# Altium project MEGA2560_Rev3e.PrjPcb
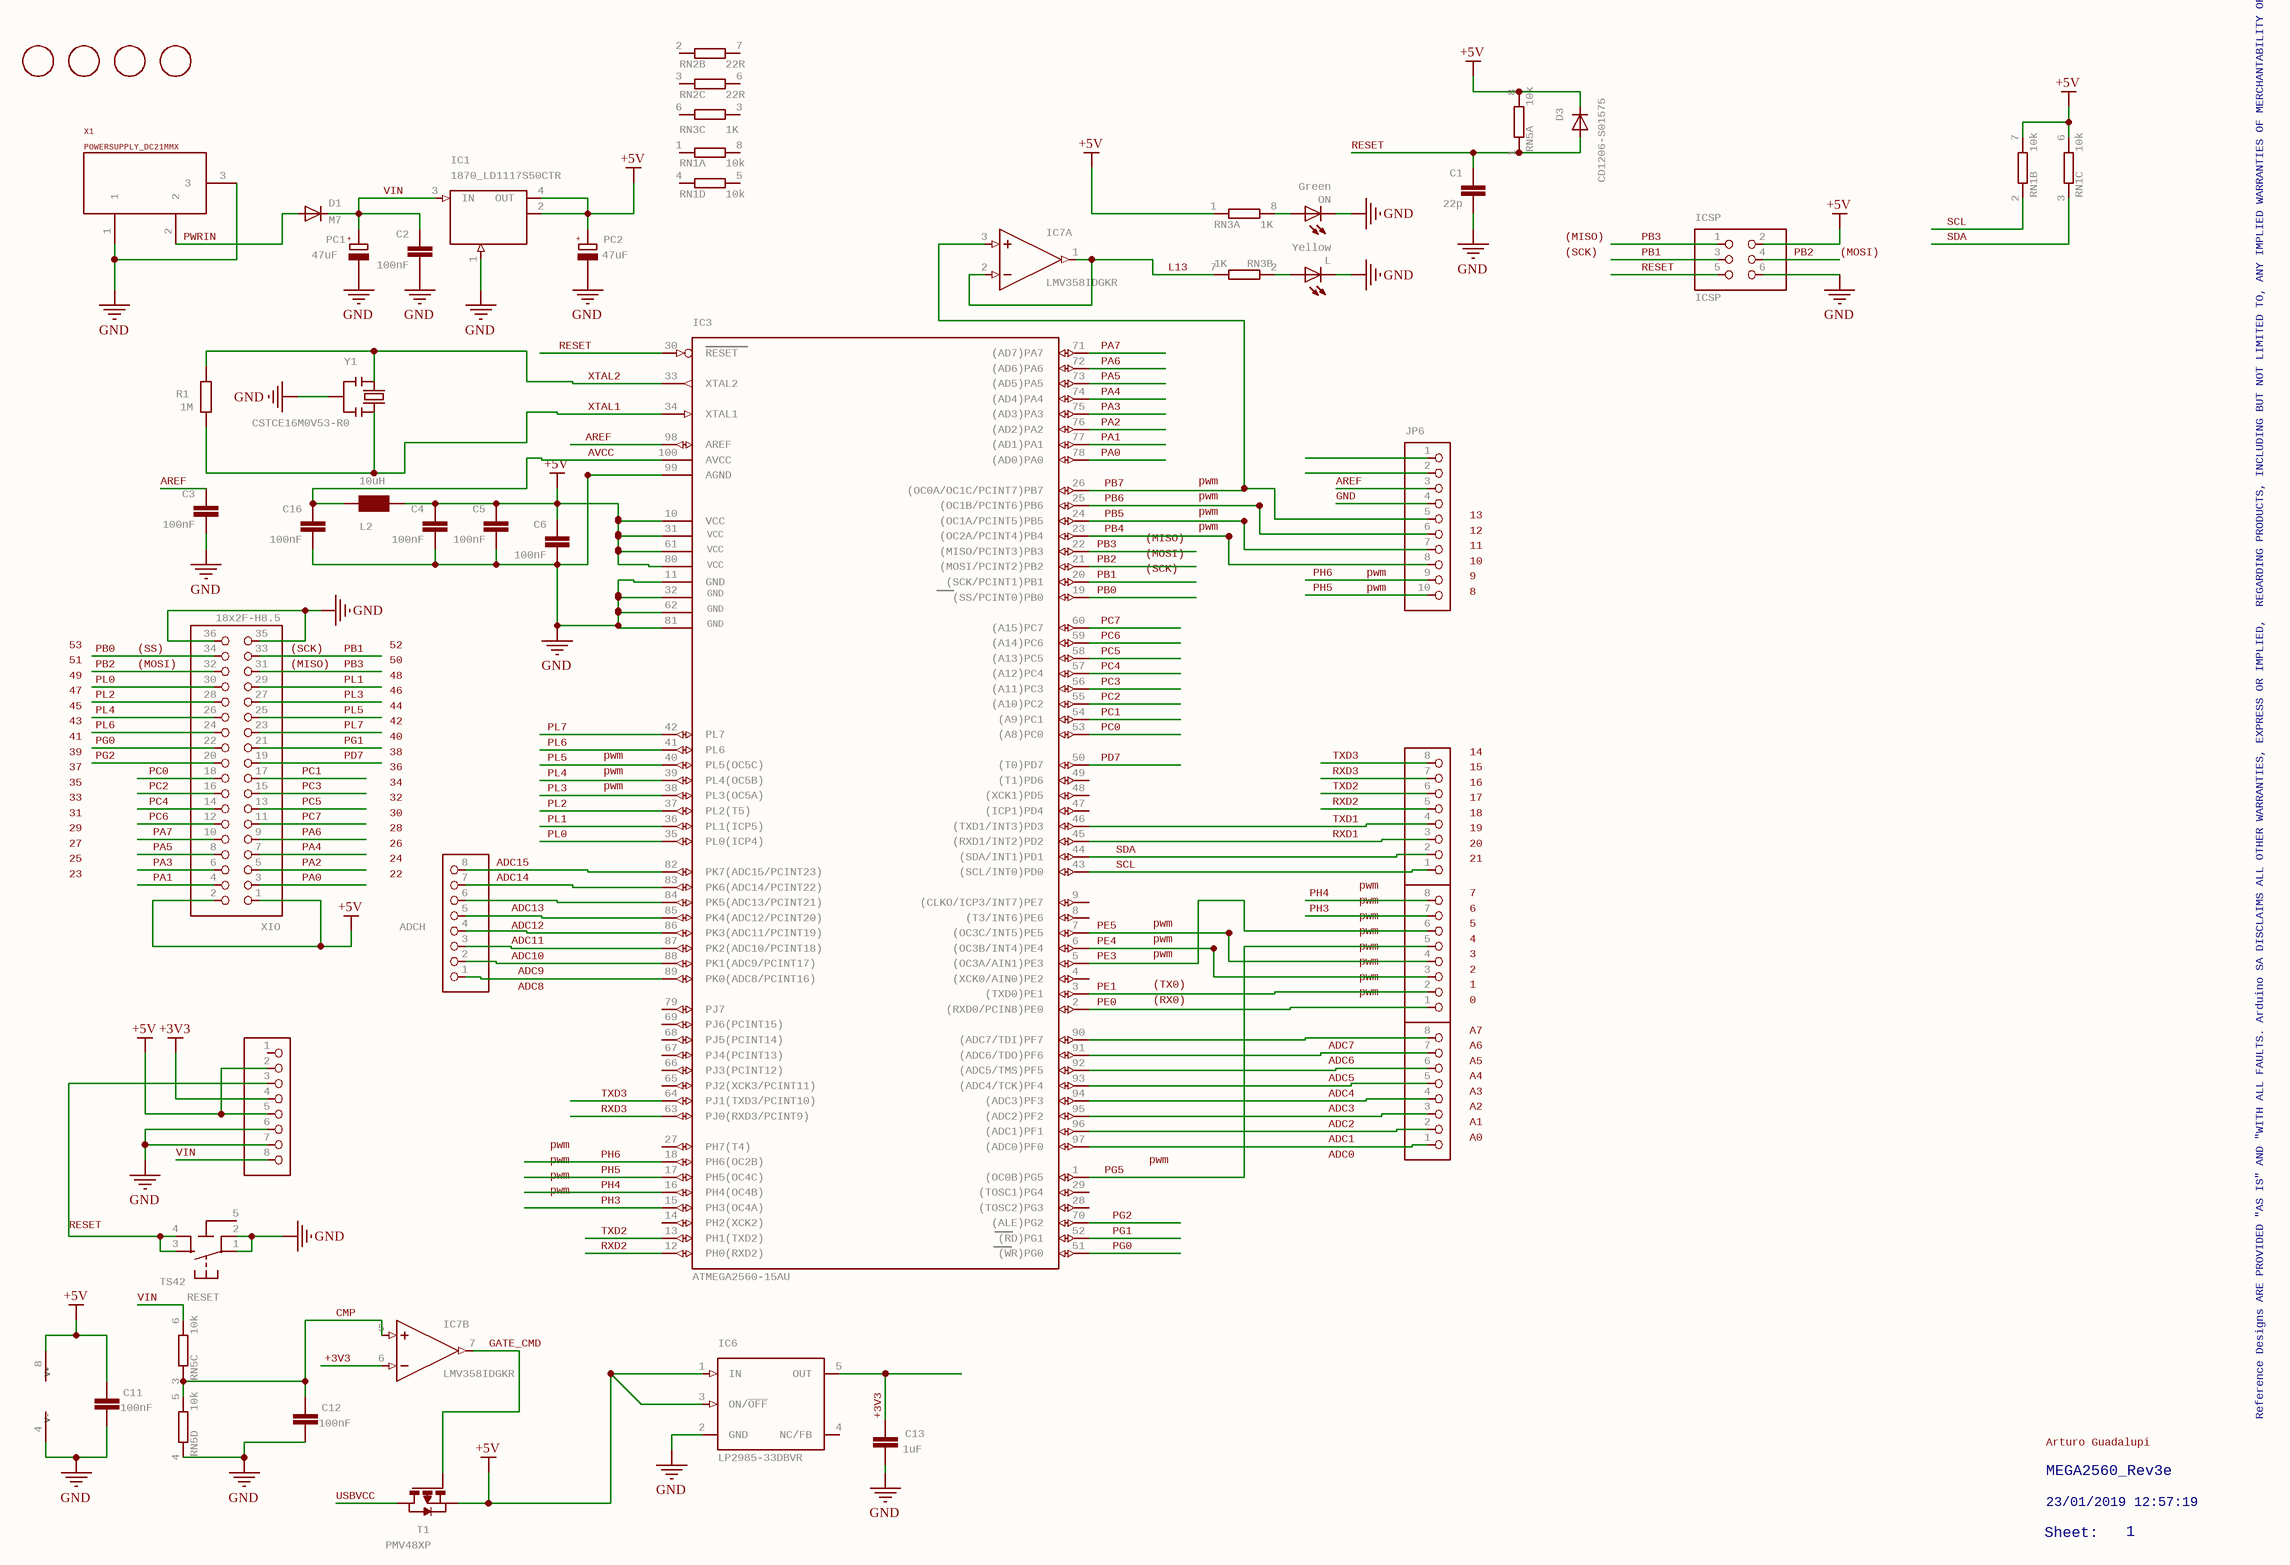
[diagram p0: MEGA2560_Rev3e_0.SchDoc]
2 sheets, 64 parts. Net scope: global (net labels, ports and power ports of the same name join across sheets).
Board file: MEGA2560_Rev3e.PcbDoc
Sheets:
  MEGA2560_Rev3e_0.SchDoc
  MEGA2560_Rev3e_1.SchDoc

## Sheet MEGA2560_Rev3e_0.SchDoc: MEGA2560_Rev3e
size 409 x 293 mm; Origin: Eagle; Date: 23/01/2019 12:57:19; SheetNumber: 1; CODE-ARDUINO: DNP; DATASHEET: DNP; DISTRIBUTOR-LINK: DNP; DISTRIBUTOR-PN: DNP; MANUFACTURER: DNP; MANUFACTURER-PN: DNP; NOTE: DNP; Value: DNP; GateName_1: G$1; SymbolName_1: A3L-LOC; LibraryName: Arduino-utility; DeviceSetName: A3-FRAME; Sheet: Sheet:; ReferenceDesignsAREPROVIDED"ASIS"AND"WITHALLFAULTS.ArduinoSADISCLAIMSALLOTHERWARRANTIES,EXPRESSORIMPLIED,
REGARDINGPRODUCTS,INCLUDINGBUTNOTLIMITEDTO,ANYIMPLIEDWARRANTIESOFMERCHANTABILITYORFITNESSFORAPARTICULARPURPOSE

ArduinoSAmaymakechangestospecificationsandproductdescriptionsatanytime,withoutnotice.TheCustomermustnot
relyontheabsenceorcharacteristicsofanyfeaturesorinstructionsmarked"reserved"or"undefined."ArduinoSAreserves
theseforfuturedefinitionandshallhavenoresponsibilitywhatsoeverforconflictsorincompatibilitiesarisingfromfuturechangestothem.
TheproductinformationontheWebSiteorMaterialsissubjecttochangewithoutnotice.Donotfinalizeadesignwiththisinfo

ARDUINOandotherArduinobrandsandlogosandTrademarksofArduinoSA.AllArduinoSATrademarkscannotbeusedwithoutowner'sformalpermission: Reference Designs ARE PROVIDED "AS IS" AND "WITH ALL FAULTS. Arduino SA DISCLAIMS ALL OTHER WARRANTIES, EXPRESS OR IMPLIED, / REGARDING PRODUCTS, INCLUDING BUT NOT LIMITED TO, ANY IMPLIED WARRANTIES OF MERCHANTABILITY OR FITNESS FOR A PARTICULAR PURPOSE / Arduino SA may make changes to specifications and product descriptions at any time, without notice. The Customer must not / rely on the absence or characteristics of any features or instructions marked "reserved" or "undefined." Arduino SA reserves / these for future definition and shall have no responsibility whatsoever for conflicts or incompatibilities arising from future changes to them. / The product information on the Web Site or Materials is subject to change without notice. Do not finalize a design with this info / ARDUINO and other Arduino brands and logos and Trademarks of Arduino SA. All Arduino SA Trademarks cannot be used without owner's formal permission

### Parts
ADCH  FH254-108DF08500V  [1X08]  (value not drawn)
ADCL  FH254-108DF08500V  [1X08]  (value not drawn)
C1  22p  [C0603-ROUND]
C2  100nF  [C0603-ROUND]
C3  100nF  [C0603-ROUND]
C4  100nF  [C0603-ROUND]
C5  100nF  [C0603-ROUND]
C6  100nF  [C0603-ROUND]
C11  100nF  [C0603-ROUND]
C12  100nF  [C0603-ROUND]
C13  1uF  [C0603-ROUND]
C16  100nF  [C0603-ROUND]
COMMUNICATION  FH254-108DF08500V  [1X08]  (value not drawn)
D1  M7  [SMB]
D3  CD1206-S01575  [MINIMELF]
FD1  FIDUCIALMOUNT  [FIDUCIA-MOUNT]  (value not drawn)
FD2  FIDUCIALMOUNT  [FIDUCIA-MOUNT]  (value not drawn)
FD3  FIDUCIALMOUNT  [FIDUCIA-MOUNT]  (value not drawn)
FD4  FIDUCIALMOUNT  [FIDUCIA-MOUNT]  (value not drawn)
IC1  1870_LD1117S50CTR  [LINEAR_SOT223]
IC3  ATMEGA2560-15AU  [TQFP100]
IC6  LP2985-33DBVR  [SOT23-DBV]
IC7  LMV358IDGKR  [MSOP08]  (parts A,B,C of 3)
ICSP  ICSP  [2X03]
JP6  FH254-110DF08500V  [1X10]  (value not drawn)
L  Yellow  [CHIPLED_0805]
L2  10uH  [0805]
ON  Green  [CHIPLED_0805]
PC1  47uF  [PANASONIC_D]
PC2  47uF  [PANASONIC_D]
POWER  FH254-108DF08500V  [1X08]  (value not drawn)
PWML  FH254-108DF08500V  [1X08]  (value not drawn)
R1  1M  [R0603-ROUND]
RESET  TS42  [TS42]
RN1  10k  [CAY16]  (parts A,B,C,D of 4)
RN2  22R  [CAY16]  (parts B,C of 4)
RN3  1K  [CAY16]  (parts A,B,C of 4)
RN5  10k  [CAY16]  (parts A,C,D of 4)
T1  PMV48XP  [SOT-23]
X1  POWERSUPPLY_DC21MMX  [POWERSUPPLY_DC-21MM]
XIO  18x2F-H8.5  [2X18]
Y1  CSTCE16M0V53-R0  [RESONATOR]

### Nets
+3V3: C13.2 IC6.5(OUT) IC7.6(-IN) POWER.4
+5V: C4.1 C5.1 C6.1 C11.2 D3.C IC1.2(OUT) IC1.4(OUT) IC3.10(VCC) IC3.31(VCC1) IC3.61(VCC2) IC3.80(VCC3) IC6.1(IN) IC6.3(ON/~{OFF}) IC7.8(V+) ICSP.2 L2.2 PC2.+ POWER.2 POWER.5 RN1.6 RN1.7 RN3.1 RN5.8 T1.2(S) XIO.1 XIO.2
GND: C1.2 C2.2 C3.2 C4.2 C5.2 C6.2 C11.1 C12.1 C13.1 C16.2 IC1.1(GND/ADJ) IC3.11(GND) IC3.32(GND1) IC3.62(GND2) IC3.81(GND3) IC3.99(AGND) IC6.2(GND) IC7.4(V-) ICSP.6 JP6.4 L.C ON.C PC1.- PC2.- POWER.6 POWER.7 RESET.1 RESET.2 RN5.4 X1.1 X1.3 XIO.35 XIO.36 Y1.2
ADC0: ADCL.1 IC3.97((ADC0)PF0)
ADC1: ADCL.2 IC3.96((ADC1)PF1)
ADC2: ADCL.3 IC3.95((ADC2)PF2)
ADC3: ADCL.4 IC3.94((ADC3)PF3)
ADC4: ADCL.5 IC3.93((ADC4/TCK)PF4)
ADC5: ADCL.6 IC3.92((ADC5/TMS)PF5)
ADC6: ADCL.7 IC3.91((ADC6/TDO)PF6)
ADC7: ADCL.8 IC3.90((ADC7/TDI)PF7)
ADC8: ADCH.1 IC3.89(PK0(ADC8/PCINT16))
ADC9: ADCH.2 IC3.88(PK1(ADC9/PCINT17))
ADC10: ADCH.3 IC3.87(PK2(ADC10/PCINT18))
ADC11: ADCH.4 IC3.86(PK3(ADC11/PCINT19))
ADC12: ADCH.5 IC3.85(PK4(ADC12/PCINT20))
ADC13: ADCH.6 IC3.84(PK5(ADC13/PCINT21))
ADC14: ADCH.7 IC3.83(PK6(ADC14/PCINT22))
ADC15: ADCH.8 IC3.82(PK7(ADC15/PCINT23))
AREF: C3.1 IC3.98(AREF) JP6.3
AVCC: C16.1 IC3.100(AVCC) L2.1
CMP: C12.2 IC7.5(+IN) RN5.3 RN5.5
GATE_CMD: IC7.7(OUT) T1.3(G)
L13: IC7.1(OUT) IC7.2(-IN) RN3.7
PA0: IC3.78((AD0)PA0) XIO.3
PA1: IC3.77((AD1)PA1) XIO.4
PA2: IC3.76((AD2)PA2) XIO.5
PA3: IC3.75((AD3)PA3) XIO.6
PA4: IC3.74((AD4)PA4) XIO.7
PA5: IC3.73((AD5)PA5) XIO.8
PA6: IC3.72((AD6)PA6) XIO.9
PA7: IC3.71((AD7)PA7) XIO.10
PB0: IC3.19((SS/PCINT0)PB0) XIO.34
PB1: IC3.20((SCK/PCINT1)PB1) ICSP.3 XIO.33
PB2: IC3.21((MOSI/PCINT2)PB2) ICSP.4 XIO.32
PB3: IC3.22((MISO/PCINT3)PB3) ICSP.1 XIO.31
PB4: IC3.23((OC2A/PCINT4)PB4) JP6.8
PB5: IC3.24((OC1A/PCINT5)PB5) JP6.7
PB6: IC3.25((OC1B/PCINT6)PB6) JP6.6
PB7: IC3.26((OC0A/OC1C/PCINT7)PB7) IC7.3(+IN) JP6.5
PC0: IC3.53((A8)PC0) XIO.18
PC1: IC3.54((A9)PC1) XIO.17
PC2: IC3.55((A10)PC2) XIO.16
PC3: IC3.56((A11)PC3) XIO.15
PC4: IC3.57((A12)PC4) XIO.14
PC5: IC3.58((A13)PC5) XIO.13
PC6: IC3.59((A14)PC6) XIO.12
PC7: IC3.60((A15)PC7) XIO.11
PD7: IC3.50((T0)PD7) XIO.19
PE0: IC3.2((RXD0/PCIN8)PE0) PWML.1
PE1: IC3.3((TXD0)PE1) PWML.2
PE3: IC3.5((OC3A/AIN1)PE3) PWML.6
PE4: IC3.6((OC3B/INT4)PE4) PWML.3
PE5: IC3.7((OC3C/INT5)PE5) PWML.4
PG0: IC3.51((WR)PG0) XIO.22
PG1: IC3.52((RD)PG1) XIO.21
PG2: IC3.70((ALE)PG2) XIO.20
PG5: IC3.1((OC0B)PG5) PWML.5
PH3: IC3.15(PH3(OC4A)) PWML.7
PH4: IC3.16(PH4(OC4B)) PWML.8
PH5: IC3.17(PH5(OC4C)) JP6.10
PH6: IC3.18(PH6(OC2B)) JP6.9
PL0: IC3.35(PL0(ICP4)) XIO.30
PL1: IC3.36(PL1(ICP5)) XIO.29
PL2: IC3.37(PL2(T5)) XIO.28
PL3: IC3.38(PL3(OC5A)) XIO.27
PL4: IC3.39(PL4(OC5B)) XIO.26
PL5: IC3.40(PL5(OC5C)) XIO.25
PL6: IC3.41(PL6) XIO.24
PL7: IC3.42(PL7) XIO.23
PWRIN: D1.A X1.2
RESET: C1.1 D3.A IC3.30(RESET) ICSP.5 POWER.3 RESET.3 RESET.4 RN5.1
RXD1: COMMUNICATION.3 IC3.45((RXD1/INT2)PD2)
RXD2: COMMUNICATION.5 IC3.12(PH0(RXD2))
RXD3: COMMUNICATION.7 IC3.63(PJ0(RXD3/PCINT9))
SCL: COMMUNICATION.1 IC3.43((SCL/INT0)PD0) RN1.2
SDA: COMMUNICATION.2 IC3.44((SDA/INT1)PD1) RN1.3
TXD1: COMMUNICATION.4 IC3.46((TXD1/INT3)PD3)
TXD2: COMMUNICATION.6 IC3.13(PH1(TXD2))
TXD3: COMMUNICATION.8 IC3.64(PJ1(TXD3/PCINT10))
USBVCC: T1.1(D)
VIN: C2.1 D1.C IC1.3(IN) PC1.+ POWER.8 RN5.6
XTAL1: IC3.34(XTAL1) R1.1 Y1.3
XTAL2: IC3.33(XTAL2) R1.2 Y1.1
NetL_A: L.A RN3.2
NetON_A: ON.A RN3.8

Not connected (* = marked no-connect by the designer): IC3 4((XCK0/AIN0)PE2) 8((T3/INT6)PE6) 9((CLKO/ICP3/INT7)PE7) 14(PH2(XCK2)) 27(PH7(T4)) 28((TOSC2)PG3) 29((TOSC1)PG4) 47((ICP1)PD4) 48((XCK1)PD5) 49((T1)PD6) 65(PJ2(XCK3/PCINT11)) 66(PJ3(PCINT12)) 67(PJ4(PCINT13)) 68(PJ5(PCINT14)) 69(PJ6(PCINT15)) 79(PJ7); IC6 4(NC/FB); JP6 1 2; POWER 1; RESET 5(5-GND); RN1 1 4(1) 5(2) 8(2); RN2 2(1) 3(1) 6(2) 7(2); RN3 3(1) 6(2)

### Notes on the sheet
- (SCK)
- (MISO)
- (MOSI)
- pwm
- (near JP6) pwm
- (near JP6) 9
- (near JP6) 10
- (near JP6) 11
- (near JP6) 12
- (near JP6) 13
- 53
- (SS)
- (near XIO) (SCK)
- 52
- (near JP6) 8
- 51
- 49
- 47
- 45
- 43
- (near XIO) (MOSI)
- (near XIO) (MISO)
- 50
- 48
- 46
- 44
- 42
- 33
- 35
- 37
- 41
- 39
- 32
- 34
- 36
- 40
- 38
- (near COMMUNICATION) 15
- (near COMMUNICATION) 16
- (near COMMUNICATION) 17
- (near COMMUNICATION) 14
- 23
- 25
- 27
- 29
- 31
- (near ADCH) 22
- (near ADCH) 24
- (near ADCH) 26
- (near ADCH) 28
- 30
- (near COMMUNICATION) 18
- (near COMMUNICATION) 19
- (near COMMUNICATION) 20
- 21
- (near PWML) 3
- (near PWML) 4
- (near PWML) 5
- 6
- 7
- (TX0)
- (RX0)
- 0
- (near PWML) 1
- (near PWML) 2
- A7
- A6
- (near ADCL) A5
- (near ADCL) A4
- (near ADCL) A3
- (near ADCL) A2
- (near ADCL) A1
- (near ADCL) A0
- Reference Designs ARE PROVIDED "AS IS" AND "WITH ALL FAULTS. Arduino SA DISCLAIMS ALL OTHER WARRANTIES, EXPRESS OR IMPLIED,
  REGARDING PRODUCTS, INCLUDING BUT NOT LIMITED TO, ANY IMPLIED WARRANTIES OF MERCHANTABILITY OR FITNESS FOR A PARTICULAR PURPOSE
  Arduino SA may make changes to specifications and product descriptions at any time, without notice. The Customer must not
  rely on the absence or characteristics of any features or instructions marked "reserved" or "undefined." Arduino SA reserves
  these for future definition and shall have no responsibility whatsoever for conflicts or incompatibilities arising from future changes to them.
  The product information on the Web Site or Materials is subject to change without notice. Do not finalize a design with this info
  ARDUINO and other Arduino brands and logos and Trademarks of Arduino SA. All Arduino SA Trademarks cannot be used without owner's formal permission
- Arturo Guadalupi
- MEGA2560_Rev3e
- Sheet:
- 23/01/2019 12:57:19
- 1

### Library data of the parts
ADCH ADCL COMMUNICATION = 0058_FH254-108DF08500V: Female Connector strip for Arduino bases - 8x1 F V h 8,5 p2,54mm; GateName_1: A; SymbolName_1: PINHD8; MONTHLY_USAGE: _____; LibraryName: Connettori; DeviceSetName: 0058_FH254-108DF08500V; CASE: CASE; PART_NUMBER: FH254-108DF08500V; PRICE: _____; SUPPLIER: _____; TYPE: Connettori
C1 = 0014_22PF_0603: 22pF 0603; GateName_1: G$1; SymbolName_1: C-EU; MONTHLY_USAGE: _____; TYPE: Condensatori; LibraryName: Condensatori; DeviceSetName: 0014_22PF_0603; CASE: 0603; PART_NUMBER: 22pF_0603; PRICE: _____; SUPPLIER: _____
C2-C6 C11 C12 C16 = 0015_100NF_0603: 100nF 0603 50V; PART_NUMBER: cl10b104kbnc; GateName_1: G$1; SymbolName_1: C-EU; MONTHLY_USAGE: _____; TYPE: Condensatori; LibraryName: Condensatori; DeviceSetName: 0015_100NF_0603; CASE: 0603; PRICE: _____; SUPPLIER: _____
C13 = 0006_1UF_0603/GRM188R61E105KA12D: 1uF 0603; GateName_1: G$1; SymbolName_1: C-EU; MONTHLY_USAGE: _____; TYPE: Condensatori; LibraryName: Condensatori; DeviceSetName: 0006_1UF_0603/GRM188R61E105KA12D; CASE: 0603; PART_NUMBER: 1uF_0603/GRM188R61E105KA12D; PRICE: _____; SUPPLIER: _____
D1 = 0020_M7: 1.0A 40V SURFACE MOUNT GLASS PASSIVATED RECTIFIER   M7; GateName_1: G$1; SymbolName_1: D; MONTHLY_USAGE: _____; TYPE: Diodi; LibraryName: Diodi; DeviceSetName: 0020_M7; CASE: SMA; PART_NUMBER: M7; PRICE: _____; SUPPLIER: _____
D3 = 0012_CD1206-S01575: small-signal high-speed Switching Diodes   CD1206; GateName_1: G$1; SymbolName_1: D; MONTHLY_USAGE: _____; TYPE: Diodi; LibraryName: Diodi; DeviceSetName: 0012_CD1206-S01575; CASE: 1206; PART_NUMBER: CD1206-S01575; PRICE: _____; SUPPLIER: _____
FD1-FD4 = FIDUCIALMOUNT: GateName_1: G$1; SymbolName_1: FIDUCIAL; LibraryName: SmartPrj; DeviceSetName: FIDUCIALMOUNT
IC1 = 1870_LD1117S50CTR: Low-dropout linear regulator 5V  -LM1117IMPX-5.0; GateName_1: G$1; SymbolName_1: LINEAR_VREG-O2; MONTHLY_USAGE: _____; LibraryName: IntegratedCircuits; DeviceSetName: 1870_LD1117S50CTR; CASE: SOT223; PART_NUMBER: LD1117S50CTR; PRICE: _____; SUPPLIER: _____; TYPE: Circuito_Integrato
IC3 = 0023_ATMEGA2560-16AU: 8-bit Microcontroller with 256K Bytes In-System Programmable Flash - ATMEGA2560-16AU; GateName_1: 1; SymbolName_1: 86-I/O-1; MONTHLY_USAGE: _____; LibraryName: IntegratedCircuits; DeviceSetName: 0023_ATMEGA2560-16AU; GND: GND; VCC: VCC; CASE: TQFP100_14x14; PART_NUMBER: ATMEGA2560-16AU; PRICE: _____; SUPPLIER: _____; TYPE: Circuito_Integrato
IC6 = 0008_TEXLP2985-33DBVR: 150-mA LOW-NOISE LOW-DROPOUT REGULATOR WITH SHUTDOWN   LP2985-33DBVR; GateName_1: G$1; SymbolName_1: LP2985-XXDBVR; MONTHLY_USAGE: _____; LibraryName: IntegratedCircuits; DeviceSetName: 0008_TEXLP2985-33DBVR; CASE: SOT23-5; PART_NUMBER: TEXLP2985-33DBVR; PRICE: _____; SUPPLIER: _____; TYPE: Circuito_Integrato
IC7 = 0021_LMV358IDGKR: Dual low-voltage (2.7 V to 5.5 V), operational amplifiers with rail-to-rail output swing   LMV358IDGKR; GateName_1: A; SymbolName_1: OPAMP; GateName_2: B; GateName_3: P; SymbolName_3: PWR+-; MONTHLY_USAGE: _____; SymbolName_2: OPAMP; LibraryName: IntegratedCircuits; DeviceSetName: 0021_LMV358IDGKR; CASE: MSOP8; PART_NUMBER: LMV358IDGKR; PRICE: _____; SUPPLIER: _____; TYPE: Circuito_Integrato
ICSP = 0114_PH254-203DF118A00V: 3x2 M V h 8,5 mm p2,54; GateName_1: A; SymbolName_1: PINH2X3; MONTHLY_USAGE: _____; LibraryName: Connettori; DeviceSetName: 0114_PH254-203DF118A00V; CASE: CASE; PART_NUMBER: PH254-203DF118A00V; PRICE: _____; SUPPLIER: _____; TYPE: Connettori
JP6 = 1216_FH254-110DF08500T30: Female Connector strip for Arduino bases - 10x1 F V h 8,5 p2,54 serigrafato STRISCIA VUOTA; GateName_1: A; SymbolName_1: PINHD10; MONTHLY_USAGE: _____; LibraryName: Connettori; DeviceSetName: 1216_FH254-110DF08500T30; CASE: CASE; PART_NUMBER: FH254-110DF08500T30; PRICE: _____; SUPPLIER: _____; TYPE: Connettori
L = 0044_KPT-2012YC: LED YELLOW - SMD - 0805; GateName_1: G$1; MONTHLY_USAGE: _____; SymbolName_1: LED; LibraryName: Opto; DeviceSetName: 0044_KPT-2012YC; CASE: CASE; PART_NUMBER: KPT-2012YC; PRICE: _____; SUPPLIER: _____; TYPE: Opto
L2 = 0715_CV201210-100K: 10uH 0805; GateName_1: G$1; SymbolName_1: L; MONTHLY_USAGE: _____; TYPE: Induttanze; LibraryName: Induttanze; DeviceSetName: 0715_CV201210-100K; CASE: 0805; PART_NUMBER: CV201210-100K; PRICE: _____; SUPPLIER: _____
ON = 0043_KPT-2012SGC: LED GREEN - SMD-0805; GateName_1: G$1; MONTHLY_USAGE: _____; SymbolName_1: LED; LibraryName: Opto; DeviceSetName: 0043_KPT-2012SGC; CASE: CASE; PART_NUMBER: KPT-2012SGC; PRICE: _____; SUPPLIER: _____; TYPE: Opto
PC1 PC2 = 0113_47UF: GateName_1: G$1; SymbolName_1: CPOL; MONTHLY_USAGE: _____; LibraryName: Condensatori; DeviceSetName: 0113_47UF; +: +; CASE: CASE; PART_NUMBER: 47uF; PRICE: _____; SUPPLIER: _____; TYPE: Condensatori
POWER = 1217_FH254-108DF08500T21: Female Connector strip for Arduino bases - 8x1 F V h 8,5 p2,54 serigrafato POWER; GateName_1: A; SymbolName_1: PINHD8; MONTHLY_USAGE: _____; LibraryName: Connettori; DeviceSetName: 1217_FH254-108DF08500T21; CASE: CASE; PART_NUMBER: FH254-108DF08500T21; PRICE: _____; SUPPLIER: _____; TYPE: Connettori
PWML = 1218_FH254-108DF08500T20: Female Connector strip for Arduino bases - 8x1 F V h 8,5 p2,54 serigrafato DIGITAL; GateName_1: A; SymbolName_1: PINHD8; MONTHLY_USAGE: _____; LibraryName: Connettori; DeviceSetName: 1218_FH254-108DF08500T20; CASE: CASE; PART_NUMBER: FH254-108DF08500T20; PRICE: _____; SUPPLIER: _____; TYPE: Connettori
R1 = 0004_0603_1M: 1M 0603; GateName_1: G$1; SymbolName_1: R-EU; MONTHLY_USAGE: _____; LibraryName: Resistenze; DeviceSetName: 0004_0603_1M; CASE: 0603; PART_NUMBER: 0603_1M; PRICE: _____; SUPPLIER: _____; TYPE: Resistenze
RESET = 0946_TS42031-160W-TR-7260: Pushbutton 6x6 Smd - White; PART_NUMBER: IT-1157AHNP-160G-G_GTR; GateName_1: G$1; SymbolName_1: ST-MOD_V1.4_TS42; MONTHLY_USAGE: _____; LibraryName: Switches; DeviceSetName: 0946_TS42031-160W-TR-7260; CASE: CASE; PRICE: _____; SUPPLIER: _____; TYPE: Switches
RN1 RN5 = 0016_064R_10K_/_CAY16-103J4LF: 10K 064 R; GateName_1: A; SymbolName_1: R1NV; GateName_2: B; GateName_3: C; GateName_4: D; MONTHLY_USAGE: _____; SymbolName_2: R1NV; SymbolName_3: R1NV; SymbolName_4: R1NV; LibraryName: Resistenze; DeviceSetName: 0016_064R_10K_/_CAY16-103J4LF; CASE: SMD_3,2x1,6; PART_NUMBER: 064R_10K_/_CAY16-103J4LF; PRICE: _____; SUPPLIER: _____; TYPE: Resistenze
RN2 = 0003_064R_22R_/_CAY16-220J4LF: 22R 064R; GateName_1: A; SymbolName_1: R1NV; GateName_2: B; GateName_3: C; GateName_4: D; MONTHLY_USAGE: _____; SymbolName_2: R1NV; SymbolName_3: R1NV; SymbolName_4: R1NV; LibraryName: Resistenze; DeviceSetName: 0003_064R_22R_/_CAY16-220J4LF; CASE: SMD_3,2x1,6; PART_NUMBER: 064R_22R_/_CAY16-220J4LF; PRICE: _____; SUPPLIER: _____; TYPE: Resistenze
RN3 = 0005_064R_1K_/_CAY16-102J4LF: 1K 064R; GateName_1: A; SymbolName_1: R1NV; GateName_2: B; GateName_3: C; GateName_4: D; MONTHLY_USAGE: _____; SymbolName_2: R1NV; SymbolName_3: R1NV; SymbolName_4: R1NV; LibraryName: Resistenze; DeviceSetName: 0005_064R_1K_/_CAY16-102J4LF; CASE: SMD_3,2x1,6; PART_NUMBER: 064R_1K_/_CAY16-102J4LF; PRICE: _____; SUPPLIER: _____; TYPE: Resistenze
T1 = 0297_PMV48XP: 20 V, 3.5 A P-channel Trench MOSFET - PMV48XP; SymbolName_1: P_MOSFET; MONTHLY_USAGE: _____; TYPE: Transistor; GateName_1: A; LibraryName: Transistors; DeviceSetName: 0297_PMV48XP; CASE: SOT23; PART_NUMBER: PMV48XP; PRICE: _____; SUPPLIER: _____
X1 = POWERSUPPLY_DC21MMX: GateName_1: G$1; SymbolName_1: POWERSUPPLY_DC21PWR; DeviceName: X; LibraryName: SmartPrj; DeviceSetName: POWERSUPPLY_DC21MM
XIO = 0060_FH254-218DF08500V: 18x2 F V h 8,5 p2,54; GateName_1: A; SymbolName_1: PINH2X18; MONTHLY_USAGE: _____; LibraryName: Connettori; DeviceSetName: 0060_FH254-218DF08500V; CASE: CASE; PART_NUMBER: FH254-218DF08500V; PRICE: _____; SUPPLIER: _____; TYPE: Connettori
Y1 = 0011_CSTCE16M0V53-R0: 16Mhz - SMD; GateName_1: G$1; MONTHLY_USAGE: _____; SymbolName_1: RESONATOR; LibraryName: Cristalli; DeviceSetName: 0011_CSTCE16M0V53-R0; CASE: CASE; PART_NUMBER: CSTCE16M0V53-R0; PRICE: _____; SUPPLIER: _____; TYPE: Cristalli

## Sheet MEGA2560_Rev3e_1.SchDoc: MEGA2560_Rev3e
size 409 x 289 mm; Origin: Eagle; Date: 23/01/2019 12:57:19; SheetNumber: 2; CODE-ARDUINO: DNP; DATASHEET: DNP; DISTRIBUTOR-LINK: DNP; DISTRIBUTOR-PN: DNP; MANUFACTURER: DNP; MANUFACTURER-PN: DNP; NOTE: DNP; Value: DNP; GateName_1: G$1; SymbolName_1: A3L-LOC; LibraryName: Arduino-utility; DeviceSetName: A3-FRAME; Sheet: Sheet:; ReferenceDesignsAREPROVIDED"ASIS"AND"WITHALLFAULTS.ArduinoSADISCLAIMSALLOTHERWARRANTIES,EXPRESSORIMPLIED,
REGARDINGPRODUCTS,INCLUDINGBUTNOTLIMITEDTO,ANYIMPLIEDWARRANTIESOFMERCHANTABILITYORFITNESSFORAPARTICULARPURPOSE

ArduinoSAmaymakechangestospecificationsandproductdescriptionsatanytime,withoutnotice.TheCustomermustnot
relyontheabsenceorcharacteristicsofanyfeaturesorinstructionsmarked"reserved"or"undefined."ArduinoSAreserves
theseforfuturedefinitionandshallhavenoresponsibilitywhatsoeverforconflictsorincompatibilitiesarisingfromfuturechangestothem.
TheproductinformationontheWebSiteorMaterialsissubjecttochangewithoutnotice.Donotfinalizeadesignwiththisinfo

ARDUINOandotherArduinobrandsandlogosandTrademarksofArduinoSA.AllArduinoSATrademarkscannotbeusedwithoutowner'sformalpermission: Reference Designs ARE PROVIDED "AS IS" AND "WITH ALL FAULTS. Arduino SA DISCLAIMS ALL OTHER WARRANTIES, EXPRESS OR IMPLIED, / REGARDING PRODUCTS, INCLUDING BUT NOT LIMITED TO, ANY IMPLIED WARRANTIES OF MERCHANTABILITY OR FITNESS FOR A PARTICULAR PURPOSE / Arduino SA may make changes to specifications and product descriptions at any time, without notice. The Customer must not / rely on the absence or characteristics of any features or instructions marked "reserved" or "undefined." Arduino SA reserves / these for future definition and shall have no responsibility whatsoever for conflicts or incompatibilities arising from future changes to them. / The product information on the Web Site or Materials is subject to change without notice. Do not finalize a design with this info / ARDUINO and other Arduino brands and logos and Trademarks of Arduino SA. All Arduino SA Trademarks cannot be used without owner's formal permission
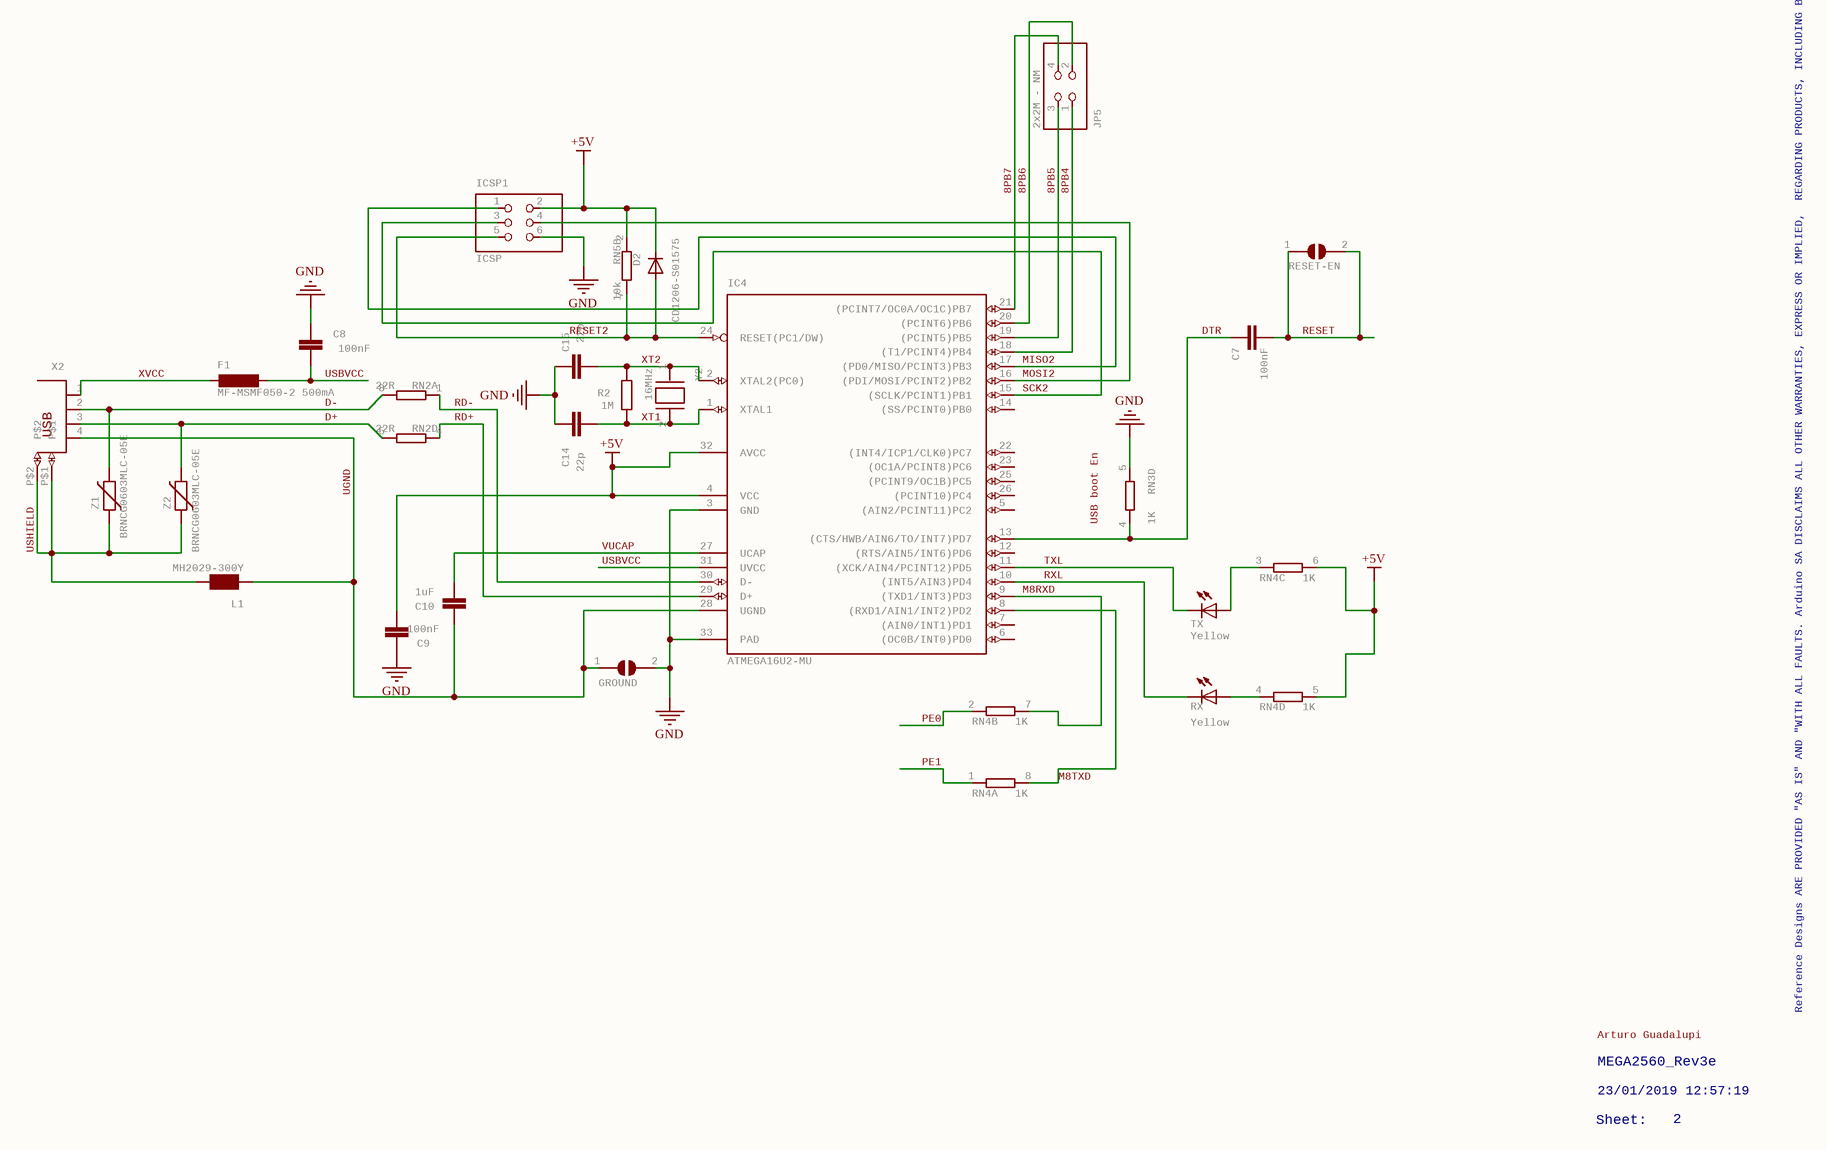
[diagram p1: MEGA2560_Rev3e_1.SchDoc]

### Parts
C7  100nF  [C0603-ROUND]
C8  100nF  [C0603-ROUND]
C9  100nF  [C0603-ROUND]
C10  1uF  [C0603-ROUND]
C14  22p  [C0603-ROUND]
C15  22p  [C0603-ROUND]
D2  CD1206-S01575  [MINIMELF]
F1  MF-MSMF050-2 500mA  [L1812]
GROUND  SJ  [SJ]  (value not drawn)
IC4  ATMEGA16U2-MU  [MLF32]
ICSP1  ICSP  [2X03]
JP5  2x2M - NM  [2X02]
L1  MH2029-300Y  [0805]
R2  1M  [R0603-ROUND]
RESET-EN  SJ  [SJ]  (value not drawn)
RN2  22R  [CAY16]  (parts A,D of 4)
RN3  1K  [CAY16]  (part D of 4)
RN4  1K  [CAY16]  (parts A,B,C,D of 4)
RN5  10k  [CAY16]  (part B of 4)
RX  Yellow  [CHIPLED_0805]
TX  Yellow  [CHIPLED_0805]
X2  0056_USB-B-S-RA-WT-SPCC  [PN61729]  (value not drawn)
Y2  16MHz  [QS]
Z1  BRNCG0603MLC-05E  [CT/CN0603]
Z2  BRNCG0603MLC-05E  [CT/CN0603]

### Nets
+5V: C9.1 D2.C IC4.4(VCC) IC4.32(AVCC) ICSP1.2 RN4.5 RN4.6 RN5.2
GND: C8.2 C9.2 C14.2 C15.2 GROUND.2 IC4.3(GND) IC4.33(PAD) ICSP1.6 RN3.5
8PB4: IC4.18((T1/PCINT4)PB4) JP5.1
8PB5: IC4.19((PCINT5)PB5) JP5.3
8PB6: IC4.20((PCINT6)PB6) JP5.2
8PB7: IC4.21((PCINT7/OC0A/OC1C)PB7) JP5.4
D+: RN2.5 X2.3 Z2.2
D-: RN2.8 X2.2 Z1.2
DTR: C7.1 IC4.13((CTS/HWB/AIN6/TO/INT7)PD7) RN3.4
M8RXD: IC4.9((TXD1/INT3)PD3) RN4.7
M8TXD: IC4.8((RXD1/AIN1/INT2)PD2) RN4.8
MISO2: IC4.17((PD0/MISO/PCINT3)PB3) ICSP1.1
MOSI2: IC4.16((PDI/MOSI/PCINT2)PB2) ICSP1.4
PE0: RN4.2
PE1: RN4.1
RD+: IC4.29(D+) RN2.4
RD-: IC4.30(D-) RN2.1
RESET: C7.2 RESET-EN.1 RESET-EN.2
RESET2: D2.A IC4.24(RESET(PC1/DW)) ICSP1.5 RN5.7
RXL: IC4.10((INT5/AIN3)PD4) RX.C
SCK2: IC4.15((SCLK/PCINT1)PB1) ICSP1.3
TXL: IC4.11((XCK/AIN4/PCINT12)PD5) TX.C
UGND: C10.2 GROUND.1 IC4.28(UGND) L1.1 X2.4
USBVCC: C8.1 F1.1 IC4.31(UVCC)
USHIELD: L1.2 X2.P$1 X2.P$2 Z1.1 Z2.1
VUCAP: C10.1 IC4.27(UCAP)
XT1: C14.1 IC4.1(XTAL1) R2.1 Y2.2
XT2: C15.1 IC4.2(XTAL2(PC0)) R2.2 Y2.1
XVCC: F1.2 X2.1
NetRN4_3: RN4.3 TX.A
NetRN4_4: RN4.4 RX.A

Not connected (* = marked no-connect by the designer): IC4 5((AIN2/PCINT11)PC2) 6((OC0B/INT0)PD0) 7((AIN0/INT1)PD1) 12((RTS/AIN5/INT6)PD6) 14((SS/PCINT0)PB0) 22((INT4/ICP1/CLK0)PC7) 23((OC1A/PCINT8)PC6) 25((PCINT9/OC1B)PC5) 26((PCINT10)PC4)

### Notes on the sheet
- (near RN3) USB boot En
- Reference Designs ARE PROVIDED "AS IS" AND "WITH ALL FAULTS. Arduino SA DISCLAIMS ALL OTHER WARRANTIES, EXPRESS OR IMPLIED,
  REGARDING PRODUCTS, INCLUDING BUT NOT LIMITED TO, ANY IMPLIED WARRANTIES OF MERCHANTABILITY OR FITNESS FOR A PARTICULAR PURPOSE
  Arduino SA may make changes to specifications and product descriptions at any time, without notice. The Customer must not
  rely on the absence or characteristics of any features or instructions marked "reserved" or "undefined." Arduino SA reserves
  these for future definition and shall have no responsibility whatsoever for conflicts or incompatibilities arising from future changes to them.
  The product information on the Web Site or Materials is subject to change without notice. Do not finalize a design with this info
  ARDUINO and other Arduino brands and logos and Trademarks of Arduino SA. All Arduino SA Trademarks cannot be used without owner's formal permission
- Arturo Guadalupi
- MEGA2560_Rev3e
- Sheet:
- 23/01/2019 12:57:19
- 2

### Library data of the parts
C7-C9 = 0015_100NF_0603: as C2 on sheet MEGA2560_Rev3e_0; LibraryName: Condensatori; DeviceSetName: 0015_100NF_0603; CASE: 0603; PRICE: _____; SUPPLIER: _____
C10 = 0006_1UF_0603/GRM188R61E105KA12D: as C13 on sheet MEGA2560_Rev3e_0; LibraryName: Condensatori; DeviceSetName: 0006_1UF_0603/GRM188R61E105KA12D; CASE: 0603; PART_NUMBER: 1uF_0603/GRM188R61E105KA12D; PRICE: _____; SUPPLIER: _____
C14 C15 = 0014_22PF_0603: as C1 on sheet MEGA2560_Rev3e_0; LibraryName: Condensatori; DeviceSetName: 0014_22PF_0603; CASE: 0603; PART_NUMBER: 22pF_0603; PRICE: _____; SUPPLIER: _____
D2 = 0012_CD1206-S01575: as D3 on sheet MEGA2560_Rev3e_0; LibraryName: Diodi; DeviceSetName: 0012_CD1206-S01575; CASE: 1206; PART_NUMBER: CD1206-S01575; PRICE: _____; SUPPLIER: _____
F1 = 0002_MF-MSMF050-2: 500 mA Multifuse ï¿½ Polyfuse; GateName_1: G$1; SymbolName_1: L-EU; MONTHLY_USAGE: _____; TYPE: Protezione; LibraryName: Protezione; DeviceSetName: 0002_MF-MSMF050-2; CASE: CASE; PART_NUMBER: MF-MSMF050-2; PRICE: _____; SUPPLIER: _____
GROUND RESET-EN = SJ: SMD solder JUMPER; GateName_1: 1; SymbolName_1: SJ; LibraryName: jumper; DeviceSetName: SJ
IC4 = 0007_ATMEGA16U2-MUR: 8-bit Microcontroller with 16K Bytes of ISP Flash and USB Controller   ATMEGA16U2-MUR; GateName_1: G$1; SymbolName_1: ATMEL_MEGA8U2; MONTHLY_USAGE: _____; LibraryName: IntegratedCircuits; DeviceSetName: 0007_ATMEGA16U2-MUR; CASE: QFN32_5x5; PART_NUMBER: ATMEGA16U2-MUR; PRICE: _____; SUPPLIER: _____; TYPE: Circuito_Integrato
ICSP1 = 0114_PH254-203DF118A00V: as ICSP on sheet MEGA2560_Rev3e_0; LibraryName: Connettori; DeviceSetName: 0114_PH254-203DF118A00V; CASE: CASE; PART_NUMBER: PH254-203DF118A00V; PRICE: _____; SUPPLIER: _____; TYPE: Connettori
JP5 = PINHD-2X2: PIN HEADER; GateName_1: A; SymbolName_1: PINH2X2; LibraryName: SmartPrj; DeviceSetName: PINHD-2X2
L1 = 0001_BLM21PG300SN1D_/_MH2029-300Y: BLM21; GateName_1: G$1; SymbolName_1: L; MONTHLY_USAGE: _____; TYPE: Protezione; LibraryName: Protezione; DeviceSetName: 0001_BLM21PG300SN1D_/_MH2029-300Y; CASE: CASE; PART_NUMBER: BLM21PG300SN1D_/_MH2029-300Y; PRICE: _____; SUPPLIER: _____
R2 = 0004_0603_1M: as R1 on sheet MEGA2560_Rev3e_0; LibraryName: Resistenze; DeviceSetName: 0004_0603_1M; CASE: 0603; PART_NUMBER: 0603_1M; PRICE: _____; SUPPLIER: _____; TYPE: Resistenze
RN2 = 0003_064R_22R_/_CAY16-220J4LF: as RN2 on sheet MEGA2560_Rev3e_0; SymbolName_2: R1NV; SymbolName_3: R1NV; SymbolName_4: R1NV; LibraryName: Resistenze; DeviceSetName: 0003_064R_22R_/_CAY16-220J4LF; CASE: SMD_3,2x1,6; PART_NUMBER: 064R_22R_/_CAY16-220J4LF; PRICE: _____; SUPPLIER: _____; TYPE: Resistenze
RN3 RN4 = 0005_064R_1K_/_CAY16-102J4LF: as RN3 on sheet MEGA2560_Rev3e_0; SymbolName_2: R1NV; SymbolName_3: R1NV; SymbolName_4: R1NV; LibraryName: Resistenze; DeviceSetName: 0005_064R_1K_/_CAY16-102J4LF; CASE: SMD_3,2x1,6; PART_NUMBER: 064R_1K_/_CAY16-102J4LF; PRICE: _____; SUPPLIER: _____; TYPE: Resistenze
RN5 = 0016_064R_10K_/_CAY16-103J4LF: as RN1 on sheet MEGA2560_Rev3e_0; SymbolName_2: R1NV; SymbolName_3: R1NV; SymbolName_4: R1NV; LibraryName: Resistenze; DeviceSetName: 0016_064R_10K_/_CAY16-103J4LF; CASE: SMD_3,2x1,6; PART_NUMBER: 064R_10K_/_CAY16-103J4LF; PRICE: _____; SUPPLIER: _____; TYPE: Resistenze
RX TX = 0044_KPT-2012YC: as L on sheet MEGA2560_Rev3e_0; SymbolName_1: LED; LibraryName: Opto; DeviceSetName: 0044_KPT-2012YC; CASE: CASE; PART_NUMBER: KPT-2012YC; PRICE: _____; SUPPLIER: _____; TYPE: Opto
X2 = 0056_USB-B-S-RA-WT-SPCC: USB - B; GateName_1: G$1; SymbolName_1: J11; MONTHLY_USAGE: _____; LibraryName: Connettori; DeviceSetName: 0056_USB-B-S-RA-WT-SPCC; USB: USB; CASE: CASE; PART_NUMBER: USB-B-S-RA-WT-SPCC; PRICE: _____; SUPPLIER: _____; TYPE: Connettori
Y2 = 0019_P011052006_16M: 16MHz THT; PART_NUMBER: P011052006 16M/FTX16M20S; GateName_1: G$1; SymbolName_1: XTAL; LibraryName: Cristalli; DeviceSetName: 0019_P011052006_16M; CASE: CASE; TYPE: Cristalli
Z1 Z2 = 0010_BRNCG0603MLC-05E: CG0603MLC-05E; GateName_1: G$1; SymbolName_1: VARISTOR; MONTHLY_USAGE: _____; LibraryName: Protezione; DeviceSetName: 0010_BRNCG0603MLC-05E; CASE: CASE; PART_NUMBER: BRNCG0603MLC-05E; PRICE: _____; SUPPLIER: _____; TYPE: Protezione

## Nets that join several sheets
+5V: MEGA2560_Rev3e_0 (26 pins), MEGA2560_Rev3e_1 (8 pins)
GND: MEGA2560_Rev3e_0 (34 pins), MEGA2560_Rev3e_1 (9 pins)
PE0: MEGA2560_Rev3e_0 (IC3.2 PWML.1), MEGA2560_Rev3e_1 (RN4.2)
PE1: MEGA2560_Rev3e_0 (IC3.3 PWML.2), MEGA2560_Rev3e_1 (RN4.1)
RESET: MEGA2560_Rev3e_0 (8 pins), MEGA2560_Rev3e_1 (C7.2 RESET-EN.1 RESET-EN.2)
USBVCC: MEGA2560_Rev3e_0 (T1.1), MEGA2560_Rev3e_1 (C8.1 F1.1 IC4.31)